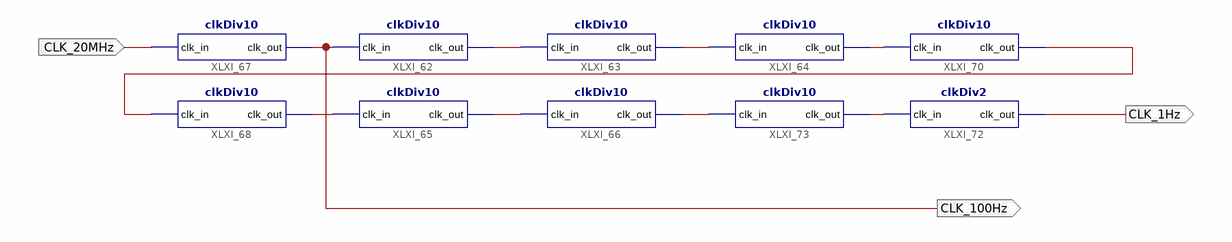
[diagram p0: schematic sheet 1]
// Xilinx ISE schematic ClockDivider.sch (spartan6) as structural Verilog: 10 symbols, 3 ports
module ClockDivider (
  input  CLK_20MHz,
  output CLK_1Hz,
  output CLK_100Hz
);

  wire XLXN_73, XLXN_74, XLXN_75, XLXN_76, XLXN_78, XLXN_79, XLXN_81, XLXN_83;

  clkDiv10 XLXI_62 (.clk_in(CLK_100Hz), .clk_out(XLXN_73));
  clkDiv10 XLXI_63 (.clk_in(XLXN_73), .clk_out(XLXN_74));
  clkDiv10 XLXI_65 (.clk_in(XLXN_76), .clk_out(XLXN_83));
  clkDiv10 XLXI_66 (.clk_in(XLXN_83), .clk_out(XLXN_78));
  clkDiv10 XLXI_68 (.clk_in(XLXN_75), .clk_out(XLXN_76));
  clkDiv10 XLXI_67 (.clk_in(CLK_20MHz), .clk_out(CLK_100Hz));
  clkDiv10 XLXI_64 (.clk_in(XLXN_74), .clk_out(XLXN_79));
  clkDiv10 XLXI_70 (.clk_in(XLXN_79), .clk_out(XLXN_75));
  clkDiv2 XLXI_72 (.clk_in(XLXN_81), .clk_out(CLK_1Hz));
  clkDiv10 XLXI_73 (.clk_in(XLXN_78), .clk_out(XLXN_81));
endmodule
